# Altium schematic sheet 1_interface.schdoc: EPS Interface
size A3; DrawnBy: Sara V. Martínez; Engineer: Flight; DocumentNumber: 2; Revision: V0.2; SheetNumber: 2; SheetTotal: 11; Designed by: Andre M. P. Mattos; ProjectRevision: v0.2; ProjectName: FloripaSat
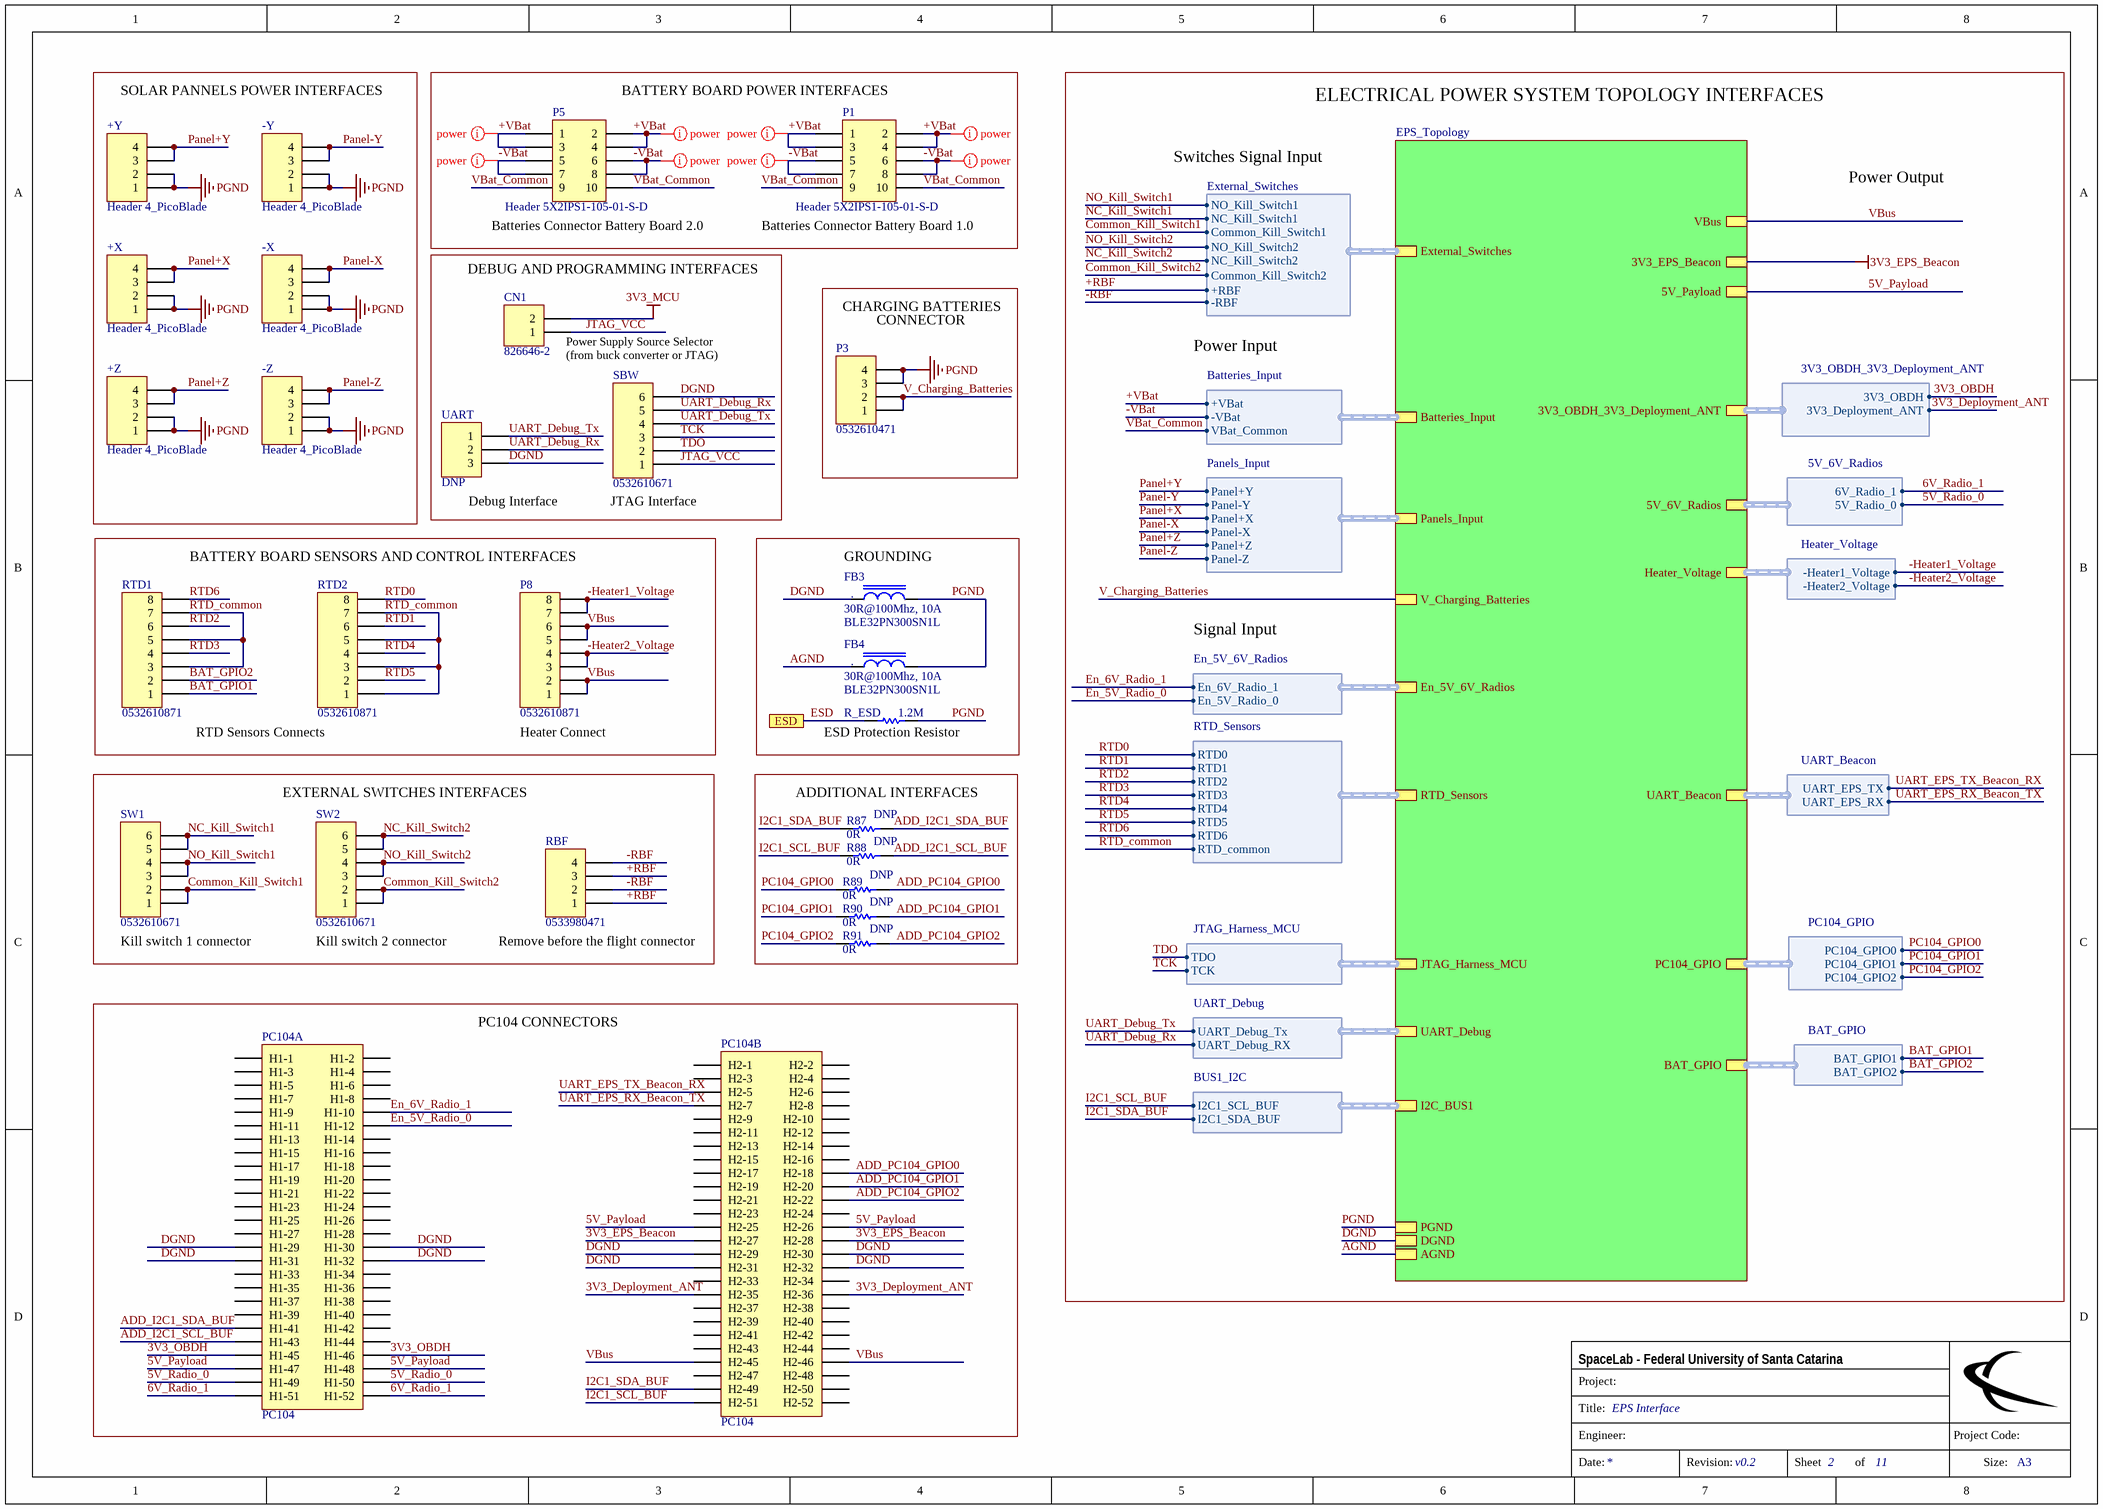
[diagram p0: 1_interface.schdoc]

## Parts
+X  Header 4_PicoBlade  [HDR4 PicoBlade]
+Y  Header 4_PicoBlade  [HDR4 PicoBlade]
+Z  Header 4_PicoBlade  [HDR4 PicoBlade]
-X  Header 4_PicoBlade  [HDR4 PicoBlade]
-Y  Header 4_PicoBlade  [HDR4 PicoBlade]
-Z  Header 4_PicoBlade  [HDR4 PicoBlade]
CN1  826646-2  [HDR 1X2]
FB3  30R@100Mhz, 10A  Manufacturer Part Number: BLE32PN300SN1L  [IND1210]
FB4  30R@100Mhz, 10A  Manufacturer Part Number: BLE32PN300SN1L  [IND1210]
P1  Header 5X2IPS1-105-01-S-D  [IPS1-105-01-S-D]
P3  0532610471  [PICOBLADE 4PIN RIGHT ANGLE]
P5  Header 5X2IPS1-105-01-S-D  [IPS1-105-01-S-D]
P8  0532610871  [PICOBLADE 8PIN RIGHT ANGLE]
PC104  PC104  [PC104]  (parts A,B of 2)
R87  0R  [0805]
R88  0R  [0805]
R89  0R  [0805]
R90  0R  [0805]
R91  0R  [0805]
R_ESD  1.2M  [0805]
RBF  0533980471  [PICOBLADE 4PIN VERTICAL]
RTD1  0532610871  [PICOBLADE 8PIN RIGHT ANGLE]
RTD2  0532610871  [PICOBLADE 8PIN RIGHT ANGLE]
SBW  0532610671  [PICOBLADE 6PIN Right Angle]
SW1  0532610671  [PICOBLADE 6PIN Right Angle]
SW2  0532610671  [PICOBLADE 6PIN Right Angle]
UART  DNP  [HDR 1X3]

## Blocks framed on the sheet
SOLAR PANNELS POWER INTERFACES: +X +Y +Z -X -Y -Z
BATTERY BOARD POWER INTERFACES: P1 P5
DEBUG AND PROGRAMMING INTERFACES: CN1 SBW UART
BATTERY BOARD SENSORS AND CONTROL INTERFACES: P8 RTD1 RTD2
GROUNDING: FB3 FB4 R_ESD
EXTERNAL SWITCHES INTERFACES: RBF SW1 SW2
ADDITIONAL INTERFACES: R87-R91
PC104 CONNECTORS: PC104

## Sub-sheets
EPS_Topology = 2_topology.schdoc: Panels_Input (harness Panels_Input), External_Switches (harness External_Switches), Batteries_Input (harness Batteries_Input), 3V3_EPS_Beacon, 3V3_OBDH_3V3_Deployment_ANT (harness 3V3_OBDH_3V3_Deployment_ANT), VBus, Heater_Voltage (harness Heater_Voltage), RTD_Sensors (harness RTD_Sensors), JTAG_Harness_MCU (harness JTAG_Harness_MCU), UART_Debug (harness UART_Debug), UART_Beacon (harness UART_Beacon), AGND, PGND, V_Charging_Batteries, DGND, 5V_Payload, PC104_GPIO (harness PC104_GPIO), BAT_GPIO (harness BAT_GPIO), 5V_6V_Radios (harness 5V_6V_Radios), En_5V_6V_Radios (harness En_5V_6V_Radios), I2C_BUS1 (harness BUS1_I2C)

## Ports
ESD

## Harnesses
Panels_Input: Panel+Y, Panel-Y, Panel+X, Panel-X, Panel+Z, Panel-Z
Batteries_Input: +VBat, -VBat, VBat_Common
3V3_OBDH_3V3_Deployment_ANT: 3V3_OBDH, 3V3_Deployment_ANT
5V_6V_Radios: 5V_Radio_0, 6V_Radio_1
En_5V_6V_Radios: En_6V_Radio_1, En_5V_Radio_0
RTD_Sensors: RTD1, RTD2, RTD3, RTD4, RTD5, RTD6, RTD0, RTD_common
JTAG_Harness_MCU: TDO, TCK
UART_Debug: UART_Debug_Tx, UART_Debug_RX
BUS1_I2C: I2C1_SCL_BUF, I2C1_SDA_BUF
Heater_Voltage: -Heater1_Voltage, -Heater2_Voltage
External_Switches: NO_Kill_Switch1, NC_Kill_Switch1, NO_Kill_Switch2, NC_Kill_Switch2, +RBF, -RBF, Common_Kill_Switch1, Common_Kill_Switch2
UART_Beacon: UART_EPS_RX, UART_EPS_TX
PC104_GPIO: PC104_GPIO0, PC104_GPIO1, PC104_GPIO2
BAT_GPIO: BAT_GPIO1, BAT_GPIO2

## Nets
3V3_EPS_Beacon: PC104.H2-27 PC104.H2-28 ; sheet EPS_Topology/3V3_EPS_Beacon
3V3_MCU: CN1.2
PGND: +X.1 +X.2 +Y.1 +Y.2 +Z.1 +Z.2 -X.1 -X.2 -Y.1 -Y.2 -Z.1 -Z.2 FB3.2 FB4.2 P3.3 P3.4 R_ESD.1 ; sheet EPS_Topology/PGND
3V3_Deployment_ANT: PC104.H2-35 PC104.H2-36 ; sheet EPS_Topology/3V3_OBDH_3V3_Deployment_ANT.3V3_Deployment_ANT
3V3_OBDH: PC104.H1-45 PC104.H1-46 ; sheet EPS_Topology/3V3_OBDH_3V3_Deployment_ANT.3V3_OBDH
5V_Payload: PC104.H1-47 PC104.H1-48 PC104.H2-25 PC104.H2-26 ; sheet EPS_Topology/5V_Payload
5V_Radio_0: PC104.H1-49 PC104.H1-50 ; sheet EPS_Topology/5V_6V_Radios.5V_Radio_0
6V_Radio_1: PC104.H1-51 PC104.H1-52 ; sheet EPS_Topology/5V_6V_Radios.6V_Radio_1
+RBF: RBF.1 RBF.3 ; sheet EPS_Topology/External_Switches.+RBF
+VBat: P1.1 P1.2 P1.3 P1.4 P5.1 P5.2 P5.3 P5.4 ; sheet EPS_Topology/Batteries_Input.+VBat
-Heater1_Voltage: P8.7 P8.8 ; sheet EPS_Topology/Heater_Voltage.-Heater1_Voltage
-Heater2_Voltage: P8.3 P8.4 ; sheet EPS_Topology/Heater_Voltage.-Heater2_Voltage
-RBF: RBF.2 RBF.4 ; sheet EPS_Topology/External_Switches.-RBF
-VBat: P1.5 P1.6 P1.7 P1.8 P5.5 P5.6 P5.7 P5.8 ; sheet EPS_Topology/Batteries_Input.-VBat
ADD_I2C1_SCL_BUF: PC104.H1-43 R88.1
ADD_I2C1_SDA_BUF: PC104.H1-41 R87.1
ADD_PC104_GPIO0: PC104.H2-18 R89.1
ADD_PC104_GPIO1: PC104.H2-20 R90.1
ADD_PC104_GPIO2: PC104.H2-22 R91.1
AGND: FB4.1 ; sheet EPS_Topology/AGND
BAT_GPIO1: RTD1.1 ; sheet EPS_Topology/BAT_GPIO.BAT_GPIO1
BAT_GPIO2: RTD1.2 ; sheet EPS_Topology/BAT_GPIO.BAT_GPIO2
Common_Kill_Switch1: SW1.1 SW1.2 ; sheet EPS_Topology/External_Switches.Common_Kill_Switch1
Common_Kill_Switch2: SW2.1 SW2.2 ; sheet EPS_Topology/External_Switches.Common_Kill_Switch2
DGND: FB3.1 PC104.H1-29 PC104.H1-30 PC104.H1-31 PC104.H1-32 PC104.H2-29 PC104.H2-30 PC104.H2-31 PC104.H2-32 SBW.6 UART.3 ; sheet EPS_Topology/DGND
En_5V_Radio_0: PC104.H1-12 ; sheet EPS_Topology/En_5V_6V_Radios.En_5V_Radio_0
En_6V_Radio_1: PC104.H1-10 ; sheet EPS_Topology/En_5V_6V_Radios.En_6V_Radio_1
ESD: R_ESD.2 ; port ESD
I2C1_SCL_BUF: PC104.H2-51 R88.2 ; sheet EPS_Topology/I2C_BUS1.I2C1_SCL_BUF
I2C1_SDA_BUF: PC104.H2-49 R87.2 ; sheet EPS_Topology/I2C_BUS1.I2C1_SDA_BUF
JTAG_VCC: CN1.1 SBW.1
NC_Kill_Switch1: SW1.5 SW1.6 ; sheet EPS_Topology/External_Switches.NC_Kill_Switch1
NC_Kill_Switch2: SW2.5 SW2.6 ; sheet EPS_Topology/External_Switches.NC_Kill_Switch2
NO_Kill_Switch1: SW1.3 SW1.4 ; sheet EPS_Topology/External_Switches.NO_Kill_Switch1
NO_Kill_Switch2: SW2.3 SW2.4 ; sheet EPS_Topology/External_Switches.NO_Kill_Switch2
Panel+X: +X.3 +X.4 ; sheet EPS_Topology/Panels_Input.Panel+X
Panel+Y: +Y.3 +Y.4 ; sheet EPS_Topology/Panels_Input.Panel+Y
Panel+Z: +Z.3 +Z.4 ; sheet EPS_Topology/Panels_Input.Panel+Z
Panel-X: -X.3 -X.4 ; sheet EPS_Topology/Panels_Input.Panel-X
Panel-Y: -Y.3 -Y.4 ; sheet EPS_Topology/Panels_Input.Panel-Y
Panel-Z: -Z.3 -Z.4 ; sheet EPS_Topology/Panels_Input.Panel-Z
PC104_GPIO0: R89.2 ; sheet EPS_Topology/PC104_GPIO.PC104_GPIO0
PC104_GPIO1: R90.2 ; sheet EPS_Topology/PC104_GPIO.PC104_GPIO1
PC104_GPIO2: R91.2 ; sheet EPS_Topology/PC104_GPIO.PC104_GPIO2
RTD0: RTD2.8 ; sheet EPS_Topology/RTD_Sensors.RTD0
RTD1: RTD2.6 ; sheet EPS_Topology/RTD_Sensors.RTD1
RTD2: RTD1.6 ; sheet EPS_Topology/RTD_Sensors.RTD2
RTD3: RTD1.4 ; sheet EPS_Topology/RTD_Sensors.RTD3
RTD4: RTD2.4 ; sheet EPS_Topology/RTD_Sensors.RTD4
RTD5: RTD2.2 ; sheet EPS_Topology/RTD_Sensors.RTD5
RTD6: RTD1.8 ; sheet EPS_Topology/RTD_Sensors.RTD6
RTD_common: RTD1.3 RTD1.5 RTD1.7 RTD2.1 RTD2.3 RTD2.5 RTD2.7 ; sheet EPS_Topology/RTD_Sensors.RTD_common
TCK: SBW.3 ; sheet EPS_Topology/JTAG_Harness_MCU.TCK
TDO: SBW.2 ; sheet EPS_Topology/JTAG_Harness_MCU.TDO
UART_Debug_Rx: SBW.5 UART.2 ; sheet EPS_Topology/UART_Debug.UART_Debug_RX
UART_Debug_Tx: SBW.4 UART.1 ; sheet EPS_Topology/UART_Debug.UART_Debug_Tx
UART_EPS_RX_Beacon_TX: PC104.H2-7 ; sheet EPS_Topology/UART_Beacon.UART_EPS_RX
UART_EPS_TX_Beacon_RX: PC104.H2-5 ; sheet EPS_Topology/UART_Beacon.UART_EPS_TX
V_Charging_Batteries: P3.1 P3.2 ; sheet EPS_Topology/V_Charging_Batteries
VBat_Common: P1.9 P1.10 P5.9 P5.10 ; sheet EPS_Topology/Batteries_Input.VBat_Common
VBus: P8.1 P8.2 P8.5 P8.6 PC104.H2-45 PC104.H2-46 ; sheet EPS_Topology/VBus

Not connected (* = marked no-connect by the designer): PC104 H1-1 H1-2 H1-3 H1-4 H1-5 H1-6 H1-7 H1-8 H1-9 H1-11 H1-13 H1-14 H1-15 H1-16 H1-17 H1-18 H1-19 H1-20 H1-21 H1-22 H1-23 H1-24 H1-25 H1-26 H1-27 H1-28 H1-33 H1-34 H1-35 H1-36 H1-37 H1-38 H1-39 H1-40 H1-42 H1-44 H2-1 H2-2 H2-3 H2-4 H2-6 H2-8 H2-9 H2-10 H2-11 H2-12 H2-13 H2-14 H2-15 H2-16 H2-17 H2-19 H2-21 H2-23 H2-24 H2-33 H2-34 H2-37 H2-38 H2-39 H2-40 H2-41 H2-42 H2-43 H2-44 H2-47 H2-48 H2-50

## Layout directives
net class power: +VBat, -VBat

## Notes on the sheet
- ELECTRICAL POWER SYSTEM TOPOLOGY INTERFACES
- Switches Signal Input
- Power Output
- (near P5) Batteries Connector Battery Board 2.0
- (near P1) Batteries Connector Battery Board 1.0
- CHARGING BATTERIES
- (near CN1) Power Supply Source Selector
- (from buck converter or JTAG)
- (near P3) CONNECTOR
- Power Input
- (near UART) Debug Interface
- (near SBW) JTAG Interface
- Signal Input
- RTD Sensors Connects
- (near P8) Heater Connect
- (near R_ESD) ESD Protection Resistor
- (near R87) DNP
- DNP
- (near SW1) Kill switch 1 connector
- (near SW2) Kill switch 2 connector
- (near RBF) Remove before the flight connector
- Project:
- SpaceLab - Federal University of Santa Catarina
- Title:
- Engineer:
- Project Code:
- Date:
- Revision:
- Sheet
- of
- Size:
- A3
- (in symbol FB_30R_10A_100MHz_1210) .

## Library data of the parts
+X +Y +Z -X -Y -Z = Header 4_PicoBlade: Header, 4-Pin; PartNumber: 53398-0471; Manufacturer: Molex; Body Plating: Tin; Contact Resistance: 20mR; Current Rating: 1A; Gender: Male; Glow Wire Compliant: Non-compliant; Insulation Resistance: 100MR; Number of Circuits: 4; Pitch: 1.25mm; Voltage Rating (AC): 125V; LatestRevisionDate: 17-Jul-2002; LatestRevisionNote: Re-released for DXP Platform.; Publisher: Altium Limited; Color: Natural; ComponentLink1Description: http://www.mouser.com/ds/2/276/0533980471_PCB_HEADERS-171069.pdf?src-supplier=Mouser; ComponentLink1URL: http://www.mouser.com/ds/2/276/0533980471_PCB_HEADERS-171069.pdf?src-supplier=Mouser; ComponentLink2Description: http://www.jameco.com/Jameco/Products/ProdDS/1932627.pdf?src-supplier=Jameco; ComponentLink2URL: http://www.jameco.com/Jameco/Products/ProdDS/1932627.pdf?src-supplier=Jameco; ComponentLink3Description: https://www.distrelec.biz/Web/Downloads/46/_e/gf116833-116846_e.pdf?mime=application%2Fpdf&src-supplier=Distrelec; ComponentLink3URL: https://www.distrelec.biz/Web/Downloads/46/_e/gf116833-116846_e.pdf?mime=application%2Fpdf&src-supplier=Distrelec; ComponentLink4Description: http://www.molex.com/webdocs/datasheets/pdf/en-us/0533980471_PCB_HEADERS.pdf?src-supplier=Element14; ComponentLink4URL: http://www.molex.com/webdocs/datasheets/pdf/en-us/0533980471_PCB_HEADERS.pdf?src-supplier=Element14; ComponentLink5Description: http://www.farnell.com/datasheets/1867381.pdf?src-supplier=Element14; ComponentLink5URL: http://www.farnell.com/datasheets/1867381.pdf?src-supplier=Element14; ComponentLink6Description: http://uk.rs-online.com/webdocs/13c4/0900766b813c4500.pdf?src-supplier=RSComponents; ComponentLink6URL: http://uk.rs-online.com/webdocs/13c4/0900766b813c4500.pdf?src-supplier=RSComponents; ComponentLink7Description: http://www.molex.com/webdocs/datasheets/pdf/en-us/0533980471_PCB_HEADERS.pdf?src-supplier=Farnell; ComponentLink7URL: http://www.molex.com/webdocs/datasheets/pdf/en-us/0533980471_PCB_HEADERS.pdf?src-supplier=Farnell; ComponentLink8Description: http://www.farnell.com/datasheets/2697809.pdf?src-supplier=Element14; ComponentLink8URL: http://www.farnell.com/datasheets/2697809.pdf?src-supplier=Element14; ComponentLink9Description: http://www.molex.com/webdocs/datasheets/pdf/en-us/0533980471_PCB_HEADERS.pdf?src-supplier=Avnet; ComponentLink9URL: http://www.molex.com/webdocs/datasheets/pdf/en-us/0533980471_PCB_HEADERS.pdf?src-supplier=Avnet; ComponentLink10Description: http://www.molex.com/webdocs/datasheets/pdf/en-us/0533980471_PCB_HEADERS.pdf?src-supplier=Avnet+Europe; ComponentLink10URL: http://www.molex.com/webdocs/datasheets/pdf/en-us/0533980471_PCB_HEADERS.pdf?src-supplier=Avnet+Europe; Contact Material: Bronze,Tin,Brass; Contact Plating: Tin; Flammability Rating: UL94 V-0; Housing Color: Natural; Housing Material: Nylon; Lead Free: Lead Free; Lead Pitch: 1.25mm; Manufacturer Part Number: 53398-0471; Max Operating Temperature: 85°C; Min Operating Temperature: -40°C; Mount: Surface Mount; Number of Contacts: 4; Number of Positions: 4; Number of Rows: 1; Orientation: Vertical; Package Quantity: 1000; Packaging: Tape and Reel; Pricing 1: 1=0.98, 10=0.832, 100=0.716, 500=0.6, 1000=0.391, 2000=0.342 (USD); Pricing 2: 1=1.19, 10=1.044, 100=0.901, 500=0.73716 (USD); Radiation Hardening: No; REACH SVHC: Unknown; Stock 1: 43251; Stock 2: 20817; Supplier 1: Mouser; Supplier 2: Digi-Key; Supplier Part Number 1: 538-53398-0471; Supplier Part Number 2: WM7608CT-ND; Termination: Solder; Voltage Rating (DC): 125V; Voltage Rating: 125V; Working Voltage: 125V
CN1 = 826646-2: Connector Header Through Hole 2 position 0.100" (2.54mm); LatestRevisionDate: 17-Jul-2002; LatestRevisionNote: Re-released for DXP Platform.; Publisher: Altium Limited; PartNumber: 826646-2
FB3 FB4 = FB_30R_10A_100MHz_1210: Ferrite Bead 30 OHM 10A 100MHz; Manufacturer: Murata; Impedance: 30R; Resistance: 10R; Number of Lines: 1; DC Resistance (DCR): 1.6mR; Partnumber: BLE32PN300SN1L; NCM: 8504.50.00; Supplier 1: Mouser; Supplier Part Number 1: 81-BLE32PN300SN1L; Stock 1: 0; Pricing 1: 1=0.8, 10=0.663, 25=0.532, 50=0.504, 100=0.448, 250=0.42 (USD); Mount: Surface Mount; Case/Package: 1210; Weight: 0.000564oz; Core Material: Ferrite; Case Code (Metric): 3225; Case Code (Imperial): 1210; Min Operating Temperature: -55°C; Max Operating Temperature: 125°C; Packaging: Tape and Reel; Package Quantity: 1500; Max Current Rating: 10A; Max DC Current: 10A; Termination: SMD/SMT; Length: 0.126inch; Height: 0.087inch; Width: 0.098inch; Depth: 2.5mm; Radiation Hardening: No; ComponentLink1URL: http://search.murata.co.jp/Ceramy/image/img/PDF/ENG/L0110S0100BLE32P.pdf?src-supplier=Avnet; ComponentLink1Description: http://search.murata.co.jp/Ceramy/image/img/PDF/ENG/L0110S0100BLE32P.pdf?src-supplier=Avnet; Supplier 2: Digi-Key; Supplier Part Number 2: 490-9566-1-ND; Stock 2: 11710; Pricing 2: 1=0.84, 10=0.756, 25=0.5604, 50=0.5324, 100=0.4763, 250=0.44828, 500=0.42026 (USD)
P1 P5 = Header 5X2H_IPS1-105-01-S-D-VS: 10 Position Receptacle Connector 0.100" (2.54mm); Manufacturer: Samtec; Connector Type: Receptacle,Socket; Max Voltage Rating (AC): 550V; Max Voltage Rating (DC): 777V; Number of Contacts: 10; Number of Ports: 1; Row Spacing: 0.1inch; LatestRevisionDate: 17-Jul-2002; LatestRevisionNote: Re-released for DXP Platform.; Publisher: Altium Limited; Partnumber: IPS1-105-01-S-D; Color: Black; ComponentLink1Description: http://www.samtec.com/documents/webfiles/pdf/ipt1.pdf?src-supplier=Avnet+Europe; ComponentLink1URL: http://www.samtec.com/documents/webfiles/pdf/ipt1.pdf?src-supplier=Avnet+Europe; ComponentLink2Description: http://suddendocs.samtec.com/prints/ips1-1xx-xx-xx-d-xx-mkt.pdf?src-supplier=Digi-Key; ComponentLink2URL: http://suddendocs.samtec.com/prints/ips1-1xx-xx-xx-d-xx-mkt.pdf?src-supplier=Digi-Key; ComponentLink3Description: http://www.samtec.com/documents/webfiles/pdf/ipt1.pdf?src-supplier=Avnet; ComponentLink3URL: http://www.samtec.com/documents/webfiles/pdf/ipt1.pdf?src-supplier=Avnet; Contact Material: Bronze; Contact Plating: Gold; Depth: 4.95mm; Gender: Receptacle; Housing Color: Black; Housing Material: Polymer; Lead Free: Lead Free; Length: 13.08mm; Manufacturer Part Number: IPS1-105-01-S-D; Max Operating Temperature: 125°C; Min Operating Temperature: -55°C; Mount: Through Hole; Number of Positions: 10; Number of Rows: 2; Number of Terminals: 10; Orientation: Straight; Packaging: Rail/Tube; Pitch: 2.54mm; Pricing 1: 1=3.15, 10=2.64, 100=2.3, 250=1.98, 500=1.83, 1000=1.68 (USD); Pricing 2: 1=3.15, 10=3.024, 100=2.52, 500=2.142, 1000=1.827, 5000=1.638 (USD); Radiation Hardening: No; REACH SVHC: No SVHC; Stock 1: 1713; Stock 2: 1507; Supplier 1: Mouser; Supplier 2: Digi-Key; Supplier Part Number 1: 200-IPS110501SD; Supplier Part Number 2: SAM8085-ND; Termination: Solder
P3 = 0532610471: PicoBlade 4 Position Right Angle Connector Header Surface Mount  0.049" (1.25mm); Manufacturer: Molex; Body Plating: Tin; Number of Positions: 4; Gender: Male; Current Rating: 1A; Voltage Rating: 125V; Contact Resistance: 20mR; Insulation Resistance: 100MR; Glow Wire Compliant: Non-compliant; LatestRevisionDate: 17-Jul-2002; LatestRevisionNote: Re-released for DXP Platform.; Publisher: Altium Limited; PartNumber: 0532610471; Supplier 1: Mouser; Supplier Part Number 1: 538-53398-0471; Stock 1: 43251; Pricing 1: 1=0.98, 10=0.832, 100=0.716, 500=0.6, 1000=0.391, 2000=0.342 (USD); Mount: Surface Mount; Contact Plating: Tin; Contact Material: Bronze,Tin,Brass; Color: Natural; Housing Material: Nylon; Housing Color: Natural; Min Operating Temperature: -40°C; Max Operating Temperature: 85°C; Termination: Solder; Number of Rows: 1; Packaging: Tape and Reel; Number of Contacts: 4; Orientation: Vertical; Package Quantity: 1000; Number of Circuits: 4; Voltage Rating (AC): 125V; Working Voltage: 125V; Voltage Rating (DC): 125V; Pitch: 1.25mm; Lead Pitch: 1.25mm; Radiation Hardening: No; REACH SVHC: Unknown; Lead Free: Lead Free; Flammability Rating: UL94 V-0; ComponentLink1URL: http://www.mouser.com/ds/2/276/0533980471_PCB_HEADERS-171069.pdf?src-supplier=Mouser; ComponentLink1Description: http://www.mouser.com/ds/2/276/0533980471_PCB_HEADERS-171069.pdf?src-supplier=Mouser; ComponentLink2URL: http://www.jameco.com/Jameco/Products/ProdDS/1932627.pdf?src-supplier=Jameco; ComponentLink2Description: http://www.jameco.com/Jameco/Products/ProdDS/1932627.pdf?src-supplier=Jameco; ComponentLink3URL: https://www.distrelec.biz/Web/Downloads/46/_e/gf116833-116846_e.pdf?mime=application%2Fpdf&src-supplier=Distrelec; ComponentLink3Description: https://www.distrelec.biz/Web/Downloads/46/_e/gf116833-116846_e.pdf?mime=application%2Fpdf&src-supplier=Distrelec; ComponentLink4URL: http://www.molex.com/webdocs/datasheets/pdf/en-us/0533980471_PCB_HEADERS.pdf?src-supplier=Element14; ComponentLink4Description: http://www.molex.com/webdocs/datasheets/pdf/en-us/0533980471_PCB_HEADERS.pdf?src-supplier=Element14; ComponentLink5URL: http://www.farnell.com/datasheets/1867381.pdf?src-supplier=Element14; ComponentLink5Description: http://www.farnell.com/datasheets/1867381.pdf?src-supplier=Element14; ComponentLink6URL: http://uk.rs-online.com/webdocs/13c4/0900766b813c4500.pdf?src-supplier=RSComponents; ComponentLink6Description: http://uk.rs-online.com/webdocs/13c4/0900766b813c4500.pdf?src-supplier=RSComponents; ComponentLink7URL: http://www.molex.com/webdocs/datasheets/pdf/en-us/0533980471_PCB_HEADERS.pdf?src-supplier=Farnell; ComponentLink7Description: http://www.molex.com/webdocs/datasheets/pdf/en-us/0533980471_PCB_HEADERS.pdf?src-supplier=Farnell; ComponentLink8URL: http://www.farnell.com/datasheets/2697809.pdf?src-supplier=Element14; ComponentLink8Description: http://www.farnell.com/datasheets/2697809.pdf?src-supplier=Element14; ComponentLink9URL: http://www.molex.com/webdocs/datasheets/pdf/en-us/0533980471_PCB_HEADERS.pdf?src-supplier=Avnet; ComponentLink9Description: http://www.molex.com/webdocs/datasheets/pdf/en-us/0533980471_PCB_HEADERS.pdf?src-supplier=Avnet; ComponentLink10URL: http://www.molex.com/webdocs/datasheets/pdf/en-us/0533980471_PCB_HEADERS.pdf?src-supplier=Avnet+Europe; ComponentLink10Description: http://www.molex.com/webdocs/datasheets/pdf/en-us/0533980471_PCB_HEADERS.pdf?src-supplier=Avnet+Europe; Supplier 2: Digi-Key; Supplier Part Number 2: WM7608CT-ND; Stock 2: 20817; Pricing 2: 1=1.19, 10=1.044, 100=0.901, 500=0.73716 (USD); Manufacturer Part Number: 0532610471
P8 RTD1 RTD2 = 0532610871: PicoBlade 8 Position Right Angle Connector Header Surface Mount 0.049" (1.25mm); PartNumber: 53261-0871; Manufacturer: Molex; Number of Contacts: 8; Contact Resistance: 20mR; Gender: Male; Current Rating: 1A; Voltage Rating: 125V; Insulation Resistance: 100MR; Glow Wire Compliant: Non-compliant; LatestRevisionDate: 17-Jul-2002; LatestRevisionNote: Re-released for DXP Platform.; Publisher: Altium Limited; Supplier 1: Mouser; Supplier Part Number 1: 538-53261-0871; Stock 1: 13055; Pricing 1: 1=1.31, 10=1.15, 100=0.991, 500=0.832, 1000=0.42, 2000=0.367 (USD); Mount: Surface Mount; Contact Plating: Tin; Contact Material: Bronze,Brass,Tin; Color: Beige; Housing Material: Thermoplastic; Min Operating Temperature: -40°C; Max Operating Temperature: 85°C; Termination: Solder; Number of Rows: 1; Orientation: Right Angle; Packaging: Tape and Reel; Number of Positions: 8; Package Quantity: 1000; Number of Circuits: 8; Voltage Rating (AC): 125V; Working Voltage: 125V; Voltage Rating (DC): 125V; Pitch: 1.25mm; Lead Pitch: 1.25mm; Radiation Hardening: No; REACH SVHC: Unknown; Lead Free: Lead Free; Flammability Rating: UL94 V-0; ComponentLink1URL: http://uk.rs-online.com/webdocs/13c4/0900766b813c44c3.pdf?src-supplier=RSComponents; ComponentLink1Description: http://uk.rs-online.com/webdocs/13c4/0900766b813c44c3.pdf?src-supplier=RSComponents; ComponentLink2URL: http://www.farnell.com/datasheets/1632136.pdf?src-supplier=Element14; ComponentLink2Description: http://www.farnell.com/datasheets/1632136.pdf?src-supplier=Element14; ComponentLink3URL: http://www.farnell.com/datasheets/1862905.pdf?src-supplier=Element14; ComponentLink3Description: http://www.farnell.com/datasheets/1862905.pdf?src-supplier=Element14; ComponentLink4URL: http://www.onlinecomponents.com/productFiles/mf-MOL/0532610871_pcb_headers.pdf?src-supplier=Onlinecomponents.com; ComponentLink4Description: http://www.onlinecomponents.com/productFiles/mf-MOL/0532610871_pcb_headers.pdf?src-supplier=Onlinecomponents.com; ComponentLink5URL: http://www.jameco.com/Jameco/Products/ProdDS/1932580.pdf?src-supplier=Jameco; ComponentLink5Description: http://www.jameco.com/Jameco/Products/ProdDS/1932580.pdf?src-supplier=Jameco; ComponentLink6URL: https://www.distrelec.biz/Web/Downloads/74/_e/gh116861-116874_e.pdf?mime=application%2Fpdf&src-supplier=Distrelec; ComponentLink6Description: https://www.distrelec.biz/Web/Downloads/74/_e/gh116861-116874_e.pdf?mime=application%2Fpdf&src-supplier=Distrelec; ComponentLink7URL: http://www.mouser.com/ds/2/276/0532610871_PCB_HEADERS-171054.pdf?src-supplier=Mouser; ComponentLink7Description: http://www.mouser.com/ds/2/276/0532610871_PCB_HEADERS-171054.pdf?src-supplier=Mouser; ComponentLink8URL: http://www.molex.com/webdocs/datasheets/pdf/en-us/0532610871_PCB_HEADERS.pdf?src-supplier=Avnet+Europe; ComponentLink8Description: http://www.molex.com/webdocs/datasheets/pdf/en-us/0532610871_PCB_HEADERS.pdf?src-supplier=Avnet+Europe; ComponentLink9URL: http://www.farnell.com/datasheets/1841157.pdf?src-supplier=Farnell; ComponentLink9Description: http://www.farnell.com/datasheets/1841157.pdf?src-supplier=Farnell; ComponentLink10URL: http://www.molex.com/webdocs/datasheets/pdf/en-us/0532610871_PCB_HEADERS.pdf?src-supplier=Avnet; ComponentLink10Description: http://www.molex.com/webdocs/datasheets/pdf/en-us/0532610871_PCB_HEADERS.pdf?src-supplier=Avnet; Supplier 2: Digi-Key; Supplier Part Number 2: WM7626CT-ND; Stock 2: 24265; Pricing 2: 1=1.64, 10=1.487, 100=1.2749, 500=1.0624 (USD); Manufacturer Part Number: 53261-0871
PC104 = PC104: Partnumber: SSW-126-01-G-D; Manufacturer: Samtec; Connector Type: Receptacle,Socket; Contact Resistance: 10mR; Gender: Receptacle; Mating Cycles: 100; Max Current Rating: 5.5A; Max Voltage Rating (AC): 550V; Number of Contacts: 52; Pitch: 2.54mm; Row Spacing: 0.1inch; Color: Black; ComponentLink1Description: http://suddendocs.samtec.com/prints/ssw-1xx-xx-xxx-x-xx-xxx-xx-mkt.pdf?src-supplier=Digi-Key; ComponentLink1URL: http://suddendocs.samtec.com/prints/ssw-1xx-xx-xxx-x-xx-xxx-xx-mkt.pdf?src-supplier=Digi-Key; Contact Material: Bronze; Contact Plating: Gold; Depth: 4.95mm; Housing Color: Black; Housing Material: Polymer; Lead Free: Lead Free; Length: 66.55mm; Manufacturer Part Number: SSW-126-01-G-D; Max Operating Temperature: 125°C; Min Operating Temperature: -55°C; Mount: Through Hole; Number of Positions: 52; Number of Rows: 2; Orientation: Straight; Packaging: Bulk; Pricing 1: 1=6.95, 10=5.8, 100=4.93, 250=4.4, 500=4.05, 1000=3.8 (USD); Pricing 2: 1=6.69, 10=6.415, 25=5.8576, 50=5.5786, 100=5.2996, 250=4.74176, 500=4.46284 (USD); REACH SVHC: No SVHC; Stock 1: 86; Stock 2: 0; Supplier 1: Mouser; Supplier 2: Digi-Key; Supplier Part Number 1: 200-SSW12601GD; Supplier Part Number 2: SAM1208-26-ND; Termination: Solder; Width: 4.95mm
R87-R91 = R0R_JUMPER_1/8W_0805: RES 0R OHM 1/8W JUMPER 0805; Partnumber: CRCW08050000Z0EA; Manufacturer: Vishay; Max Power Dissipation: 125mW; Resistance: 0mR; Temperature Coefficient: 100ppm/°C; Tolerance: 1%; Voltage Rating (DC): 150V; Fitted: No (jumper resistor); Case/Package: 0805; Case Code (Imperial): 0805; Case Code (Metric): 2012; ComponentLink1Description: http://www.vishay.com/docs/20035/dcrcwe3.pdf?src-supplier=Avnet+Europe; ComponentLink1URL: http://www.vishay.com/docs/20035/dcrcwe3.pdf?src-supplier=Avnet+Europe; ComponentLink2Description: http://www.vishay.com/docs/20035/dcrcwe3.pdf?src-supplier=Distrelec; ComponentLink2URL: http://www.vishay.com/docs/20035/dcrcwe3.pdf?src-supplier=Distrelec; ComponentLink3Description: http://www.vishay.com/docs/20035/dcrcwe3.pdf?src-supplier=Mouser; ComponentLink3URL: http://www.vishay.com/docs/20035/dcrcwe3.pdf?src-supplier=Mouser; ComponentLink4Description: http://uk.rs-online.com/webdocs/0d98/0900766b80d98b26.pdf?src-supplier=RSComponents; ComponentLink4URL: http://uk.rs-online.com/webdocs/0d98/0900766b80d98b26.pdf?src-supplier=RSComponents; ComponentLink5Description: http://www.vishay.com/docs/20035/dcrcwe3.pdf?src-supplier=Future+Electronics; ComponentLink5URL: http://www.vishay.com/docs/20035/dcrcwe3.pdf?src-supplier=Future+Electronics; ComponentLink6Description: http://www.vishay.com/docs/20035/dcrcwe3.pdf?src-supplier=Allied+Electronics; ComponentLink6URL: http://www.vishay.com/docs/20035/dcrcwe3.pdf?src-supplier=Allied+Electronics; ComponentLink7Description: http://www.vishay.com/docs/20035/dcrcwe3.pdf?src-supplier=Digi-Key; ComponentLink7URL: http://www.vishay.com/docs/20035/dcrcwe3.pdf?src-supplier=Digi-Key; ComponentLink8Description: http://www.farnell.com/datasheets/2310790.pdf?src-supplier=Element14; ComponentLink8URL: http://www.farnell.com/datasheets/2310790.pdf?src-supplier=Element14; Composition: Thick Film; Contact Plating: Tin,Lead; Depth: 1.25mm; Features: Automotive AEC-Q200; Height: 0.45mm; Lead Free: Lead Free; Length: 2mm; Manufacturer Part Number: CRCW08050000Z0EA; Max Operating Temperature: 155°C; Military Standard: Not; Min Operating Temperature: -55°C; Number of Terminations: 2; Package Quantity: 1; Packaging: Tape and Reel; Power Rating: 125mW; Pricing 1: 1=0.1, 10=0.024, 100=0.01, 1000=0.007, 5000=0.004, 10000=0.004 (USD); Pricing 2: 1=0.1, 10=0.04, 25=0.0288, 50=0.022, 100=0.0162, 250=0.01236, 500=0.0099, 1000=0.00729 (USD); Radiation Hardening: No; REACH SVHC: Unknown; Stock 1: 903478; Stock 2: 399530; Supplier 1: Mouser; Supplier 2: Digi-Key; Supplier Part Number 1: 71-CRCW0805-0-E3; Supplier Part Number 2: 541-0.0ADKR-ND; Termination: SMD/SMT; Voltage Rating: 150V; Weight: 0.000194oz; Width: 1.25mm
R_ESD = R1200k_1%_1/8W_0805: RES 1200K OHM 1/8W 0.1% 0805; Partnumber: RG2012P-125-B-T5; Manufacturer: Susumu; Max Power Dissipation: 125mW; Resistance: 1.2MR; Temperature Coefficient: 25ppm/°C; Case/Package: 0805; Case Code (Imperial): 0805; Case Code (Metric): 2012; Composition: Thin Film; Features: Automotive AEC-Q200,Anti-Sulfur; Manufacturer Part Number: RG2012P-125-B-T5; Max Operating Temperature: 155°C; Min Operating Temperature: -55°C; Number of Terminations: 2; Packaging: Cut Tape; Pricing 1: 1=0.61, 10=0.47, 100=0.197, 500=0.151, 1000=0.109, 2500=0.102 (USD); Pricing 2: 1=0.58, 10=0.448, 100=0.1882, 1000=0.10384, 2500=0.09735 (USD); Stock 1: 26639; Stock 2: 10826; Supplier 1: Mouser; Supplier 2: Digi-Key; Supplier Part Number 1: 754-RG2012P-125B-T5; Supplier Part Number 2: 408-2024-1-ND; Tolerance: 0.1%
RBF = 0533980471: PicoBlade 4 Position Vertical Connector Header Surface Mount  0.049" (1.25mm); PartNumber: 53398-0471; Manufacturer: Molex; Body Plating: Tin; Number of Positions: 4; Gender: Male; Current Rating: 1A; Voltage Rating: 125V; Contact Resistance: 20mR; Insulation Resistance: 100MR; Glow Wire Compliant: Non-compliant; LatestRevisionDate: 17-Jul-2002; LatestRevisionNote: Re-released for DXP Platform.; Publisher: Altium Limited; Supplier 1: Mouser; Supplier Part Number 1: 538-53398-0471; Stock 1: 43251; Pricing 1: 1=0.98, 10=0.832, 100=0.716, 500=0.6, 1000=0.391, 2000=0.342 (USD); Mount: Surface Mount; Contact Plating: Tin; Contact Material: Bronze,Tin,Brass; Color: Natural; Housing Material: Nylon; Housing Color: Natural; Min Operating Temperature: -40°C; Max Operating Temperature: 85°C; Termination: Solder; Number of Rows: 1; Packaging: Tape and Reel; Number of Contacts: 4; Orientation: Vertical; Package Quantity: 1000; Number of Circuits: 4; Voltage Rating (AC): 125V; Working Voltage: 125V; Voltage Rating (DC): 125V; Pitch: 1.25mm; Lead Pitch: 1.25mm; Radiation Hardening: No; REACH SVHC: Unknown; Lead Free: Lead Free; Flammability Rating: UL94 V-0; ComponentLink1URL: http://www.mouser.com/ds/2/276/0533980471_PCB_HEADERS-171069.pdf?src-supplier=Mouser; ComponentLink1Description: http://www.mouser.com/ds/2/276/0533980471_PCB_HEADERS-171069.pdf?src-supplier=Mouser; ComponentLink2URL: http://www.jameco.com/Jameco/Products/ProdDS/1932627.pdf?src-supplier=Jameco; ComponentLink2Description: http://www.jameco.com/Jameco/Products/ProdDS/1932627.pdf?src-supplier=Jameco; ComponentLink3URL: https://www.distrelec.biz/Web/Downloads/46/_e/gf116833-116846_e.pdf?mime=application%2Fpdf&src-supplier=Distrelec; ComponentLink3Description: https://www.distrelec.biz/Web/Downloads/46/_e/gf116833-116846_e.pdf?mime=application%2Fpdf&src-supplier=Distrelec; ComponentLink4URL: http://www.molex.com/webdocs/datasheets/pdf/en-us/0533980471_PCB_HEADERS.pdf?src-supplier=Element14; ComponentLink4Description: http://www.molex.com/webdocs/datasheets/pdf/en-us/0533980471_PCB_HEADERS.pdf?src-supplier=Element14; ComponentLink5URL: http://www.farnell.com/datasheets/1867381.pdf?src-supplier=Element14; ComponentLink5Description: http://www.farnell.com/datasheets/1867381.pdf?src-supplier=Element14; ComponentLink6URL: http://uk.rs-online.com/webdocs/13c4/0900766b813c4500.pdf?src-supplier=RSComponents; ComponentLink6Description: http://uk.rs-online.com/webdocs/13c4/0900766b813c4500.pdf?src-supplier=RSComponents; ComponentLink7URL: http://www.molex.com/webdocs/datasheets/pdf/en-us/0533980471_PCB_HEADERS.pdf?src-supplier=Farnell; ComponentLink7Description: http://www.molex.com/webdocs/datasheets/pdf/en-us/0533980471_PCB_HEADERS.pdf?src-supplier=Farnell; ComponentLink8URL: http://www.farnell.com/datasheets/2697809.pdf?src-supplier=Element14; ComponentLink8Description: http://www.farnell.com/datasheets/2697809.pdf?src-supplier=Element14; ComponentLink9URL: http://www.molex.com/webdocs/datasheets/pdf/en-us/0533980471_PCB_HEADERS.pdf?src-supplier=Avnet; ComponentLink9Description: http://www.molex.com/webdocs/datasheets/pdf/en-us/0533980471_PCB_HEADERS.pdf?src-supplier=Avnet; ComponentLink10URL: http://www.molex.com/webdocs/datasheets/pdf/en-us/0533980471_PCB_HEADERS.pdf?src-supplier=Avnet+Europe; ComponentLink10Description: http://www.molex.com/webdocs/datasheets/pdf/en-us/0533980471_PCB_HEADERS.pdf?src-supplier=Avnet+Europe; Supplier 2: Digi-Key; Supplier Part Number 2: WM7608CT-ND; Stock 2: 20817; Pricing 2: 1=1.19, 10=1.044, 100=0.901, 500=0.73716 (USD); Manufacturer Part Number: 53398-0471
SBW SW1 SW2 = 0532610671: PicoBlade 6 Position Right Angle Connector Header Surface Mount  0.049" (1.25mm); Partnumber: 53398-0671; LatestRevisionDate: 17-Jul-2002; LatestRevisionNote: Re-released for DXP Platform.; Publisher: Altium Limited
UART = Header 3H: Header, 3-Pin, Right Angle; Partnumber: 4-103327-5; Manufacturer: TE Connectivity AMP; Approvals: CSA; Board Standoff: No (Without); Connector Type: Plug,Header,Pin; Contact Current Rating: 3A; Contact Post Length: 0.12inch; High Speed Serial Data Connector: No; Insulation Resistance: 5GR; Number of Contacts: 3; PCB Mounting Orientation: Vertical; PCB Mount Retention: Without; Pitch: 2.54mm; Fitted: Yes (eng model only); LatestRevisionDate: 17-Jul-2002; LatestRevisionNote: Re-released for DXP Platform.; Publisher: Altium Limited; Contact Gender: Male; Contact Material: Bronze; Contact Mating Length: 0.23inch; Contact Plating: Tin; Contact Protection: No (Without); Contact Shape: Square; Current Rating: 3A; Depth: 2.34mm; ELV: Compliant; Flammability Rating: UL94 V-0; Gasket: No (Without); High Temperature Housing: No; Housing Color: Black; Housing Material: Thermoplastic; Keyed: No; Length: 7.21mm; Manufacturer Part Number: 4-103327-5; Mating Connector Lock: No (Without); Max Operating Temperature: 105°C; Min Operating Temperature: -65°C; Mount: Through Hole; Number of Positions: 3; Number of Rows: 1; Orientation: Straight; Package Quantity: 540; Packaging: Carton; Pricing 1: 1=0.26, 10=0.182, 100=0.157, 500=0.15, 1000=0.125, 2500=0.107 (USD); Pricing 2: 1=0.26, 10=0.25, 100=0.1753, 500=0.1503, 1000=0.12525, 5000=0.10736, 10000=0.1002 (USD); Radiation Hardening: No; Row Spacing: 2.54mm; Selectively Loaded: No (Without); Stabilizers: No (Without); Stock 1: 2961; Stock 2: 16328; Strain Relief: No (Without); Supplier 1: Mouser; Supplier 2: Digi-Key; Supplier Part Number 1: 571-4-103327-5; Supplier Part Number 2: A128778-ND; Termination: Through Hole